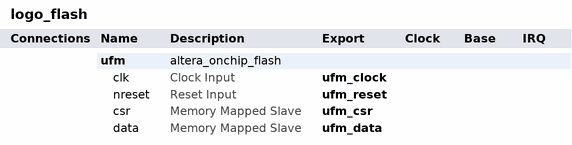
[diagram p0: system contents]
# Platform Designer (Qsys) system logo_flash, MAX 10 10M08SCE144C8G
# Parameters at their usual value, and those the tool derives, are not listed.
package require -exact qsys 25.1
create_system logo_flash
set_project_property DEVICE_FAMILY {MAX 10}
set_project_property DEVICE 10M08SCE144C8G

add_instance ufm altera_onchip_flash 25.1
set_instance_parameter_value ufm CONFIGURATION_MODE {Single Uncompressed Image}
set_instance_parameter_value ufm SECTOR_ACCESS_MODE {Read and write,Read and write,Read only,Hidden,Hidden}
set_instance_parameter_value ufm initFlashContent true
set_instance_parameter_value ufm initializationFileName logo_rom.hex
set_instance_parameter_value ufm useNonDefaultInitFile true

# exported interfaces
add_interface ufm_clock clock sink
set_interface_property ufm_clock EXPORT_OF ufm.clk
add_interface ufm_csr avalon slave
set_interface_property ufm_csr EXPORT_OF ufm.csr
add_interface ufm_data avalon slave
set_interface_property ufm_data EXPORT_OF ufm.data
add_interface ufm_reset reset sink
set_interface_property ufm_reset EXPORT_OF ufm.nreset

set_interconnect_requirement {$system} qsys_mm.clockCrossingAdapter HANDSHAKE
set_interconnect_requirement {$system} qsys_mm.enableEccProtection FALSE
set_interconnect_requirement {$system} qsys_mm.insertDefaultSlave FALSE
set_interconnect_requirement {$system} qsys_mm.maxAdditionalLatency 1

save_system logo_flash.qsys
